# Altium project TMC4671-EVAL_V1_2.PrjPcb
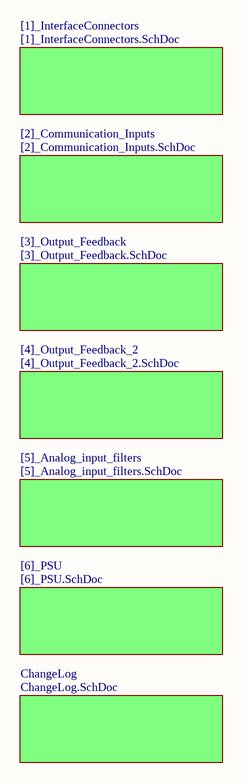
[diagram p0: TMC4671-EVAL_V1_2.SchDoc]
Interfaces: SPI, UART, S/D; Chip: TMCxxx; BoardVersion: 1.2; BoardName: TMC4671-EVAL
8 sheets, 149 parts. Net scope: flat (ports and power ports of the same name join across sheets).
Board file: TMC4671-EVAL_V1_2.PcbDoc
Sheets:
  TMC4671-EVAL_V1_2.SchDoc
    ChangeLog = ChangeLog.SchDoc
    [1]_InterfaceConnectors = [1]_InterfaceConnectors.SchDoc
    [2]_Communication_Inputs = [2]_Communication_Inputs.SchDoc
    [3]_Output_Feedback = [3]_Output_Feedback.SchDoc
    [4]_Output_Feedback_2 = [4]_Output_Feedback_2.SchDoc
    [5]_Analog_input_filters = [5]_Analog_input_filters.SchDoc
    [6]_PSU = [6]_PSU.SchDoc

## Sheet TMC4671-EVAL_V1_2.SchDoc: TMC4671_EVAL_V1.0
size A4; DocumentNumber: 0; SheetNumber: 0; SheetTotal: 8

### Sub-sheets
[1]_InterfaceConnectors = [1]_InterfaceConnectors.SchDoc: no entries
[2]_Communication_Inputs = [2]_Communication_Inputs.SchDoc: no entries
[3]_Output_Feedback = [3]_Output_Feedback.SchDoc: no entries
[4]_Output_Feedback_2 = [4]_Output_Feedback_2.SchDoc: no entries
[5]_Analog_input_filters = [5]_Analog_input_filters.SchDoc: no entries
[6]_PSU = [6]_PSU.SchDoc: no entries
ChangeLog = ChangeLog.SchDoc: no entries

### Notes on the sheet
- Title:
- Size:
- Date:
- A4
- Project:
- Time:
- Sheet
- Version:
- of
- File:

## Sheet ChangeLog.SchDoc: ChangeLog
size A4; DocumentNumber: 7; SheetNumber: 7; SheetTotal: 8
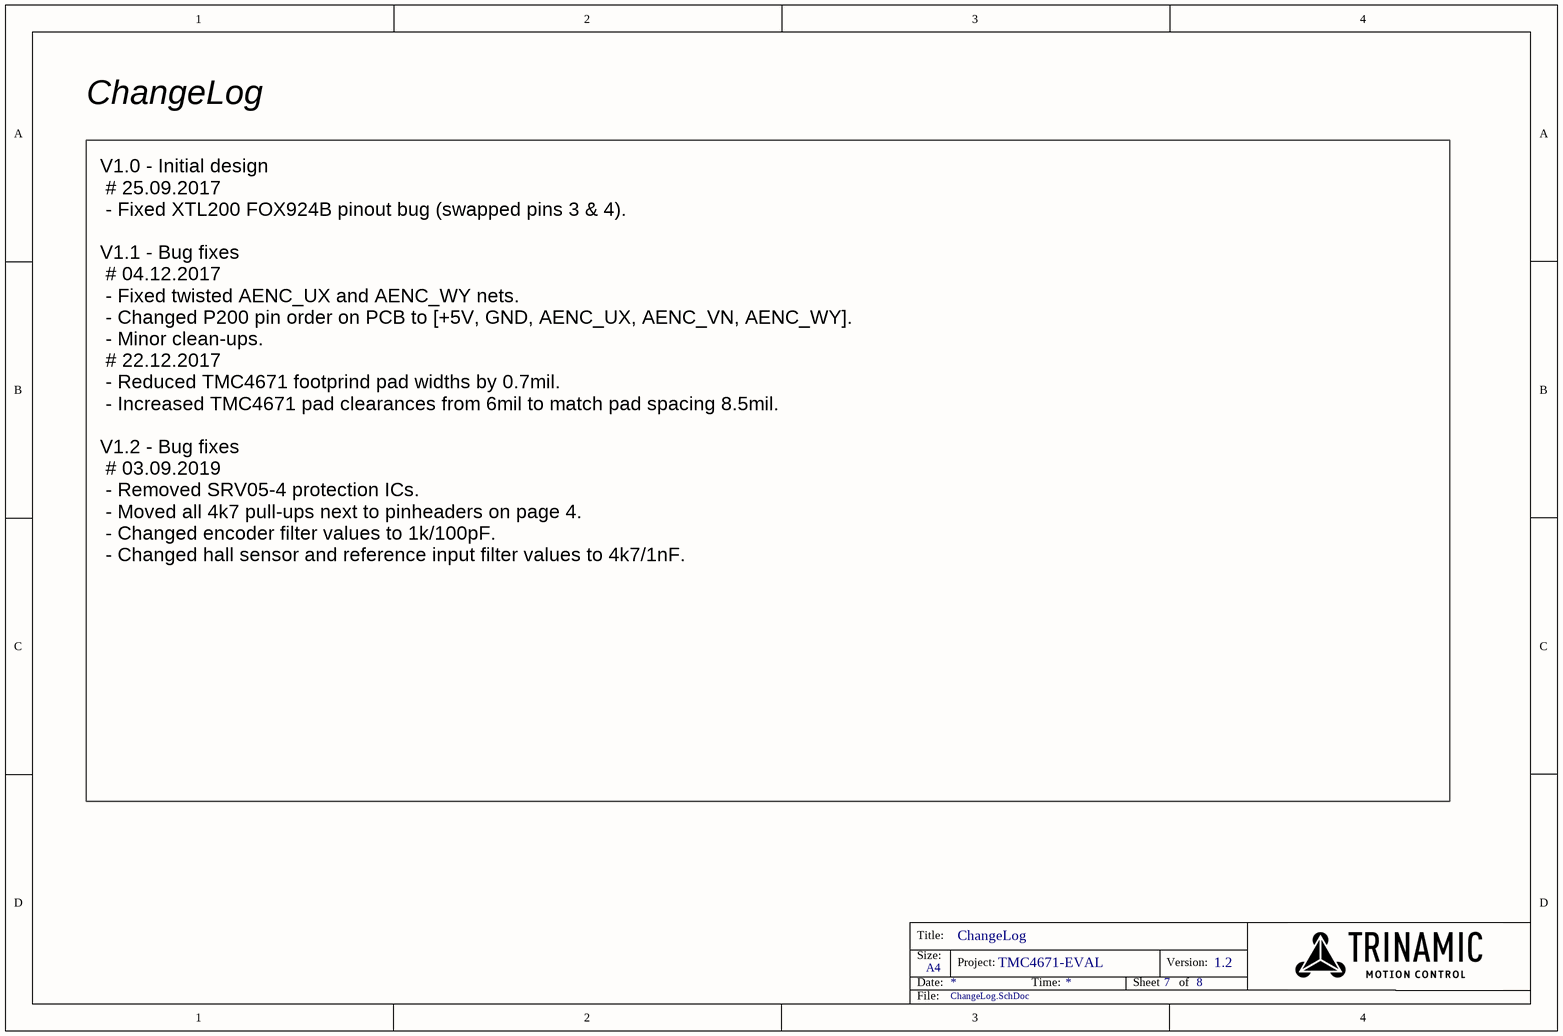
[diagram p1: ChangeLog.SchDoc]

### Notes on the sheet
- ChangeLog
- V1.0 - Initial design
  # 25.09.2017
  - Fixed XTL200 FOX924B pinout bug (swapped pins 3 & 4).
  V1.1 - Bug fixes
  # 04.12.2017
  - Fixed twisted AENC_UX and AENC_WY nets.
  - Changed P200 pin order on PCB to [+5V, GND, AENC_UX, AENC_VN, AENC_WY].
  - Minor clean-ups.
  # 22.12.2017
  - Reduced TMC4671 footprind pad widths by 0.7mil.
  - Increased TMC4671 pad clearances from 6mil to match pad spacing 8.5mil.
  V1.2 - Bug fixes
  # 03.09.2019
  - Removed SRV05-4 protection ICs.
  - Moved all 4k7 pull-ups next to pinheaders on page 4.
  - Changed encoder filter values to 1k/100pF.
  - Changed hall sensor and reference input filter values to 4k7/1nF.
- Title:
- Size:
- Date:
- A4
- Project:
- Time:
- Sheet
- Version:
- of
- File:

## Sheet [1]_InterfaceConnectors.SchDoc: Interface connectors, mounting holes & testpads
size A4; DocumentNumber: 1; SheetNumber: 1; SheetTotal: 8
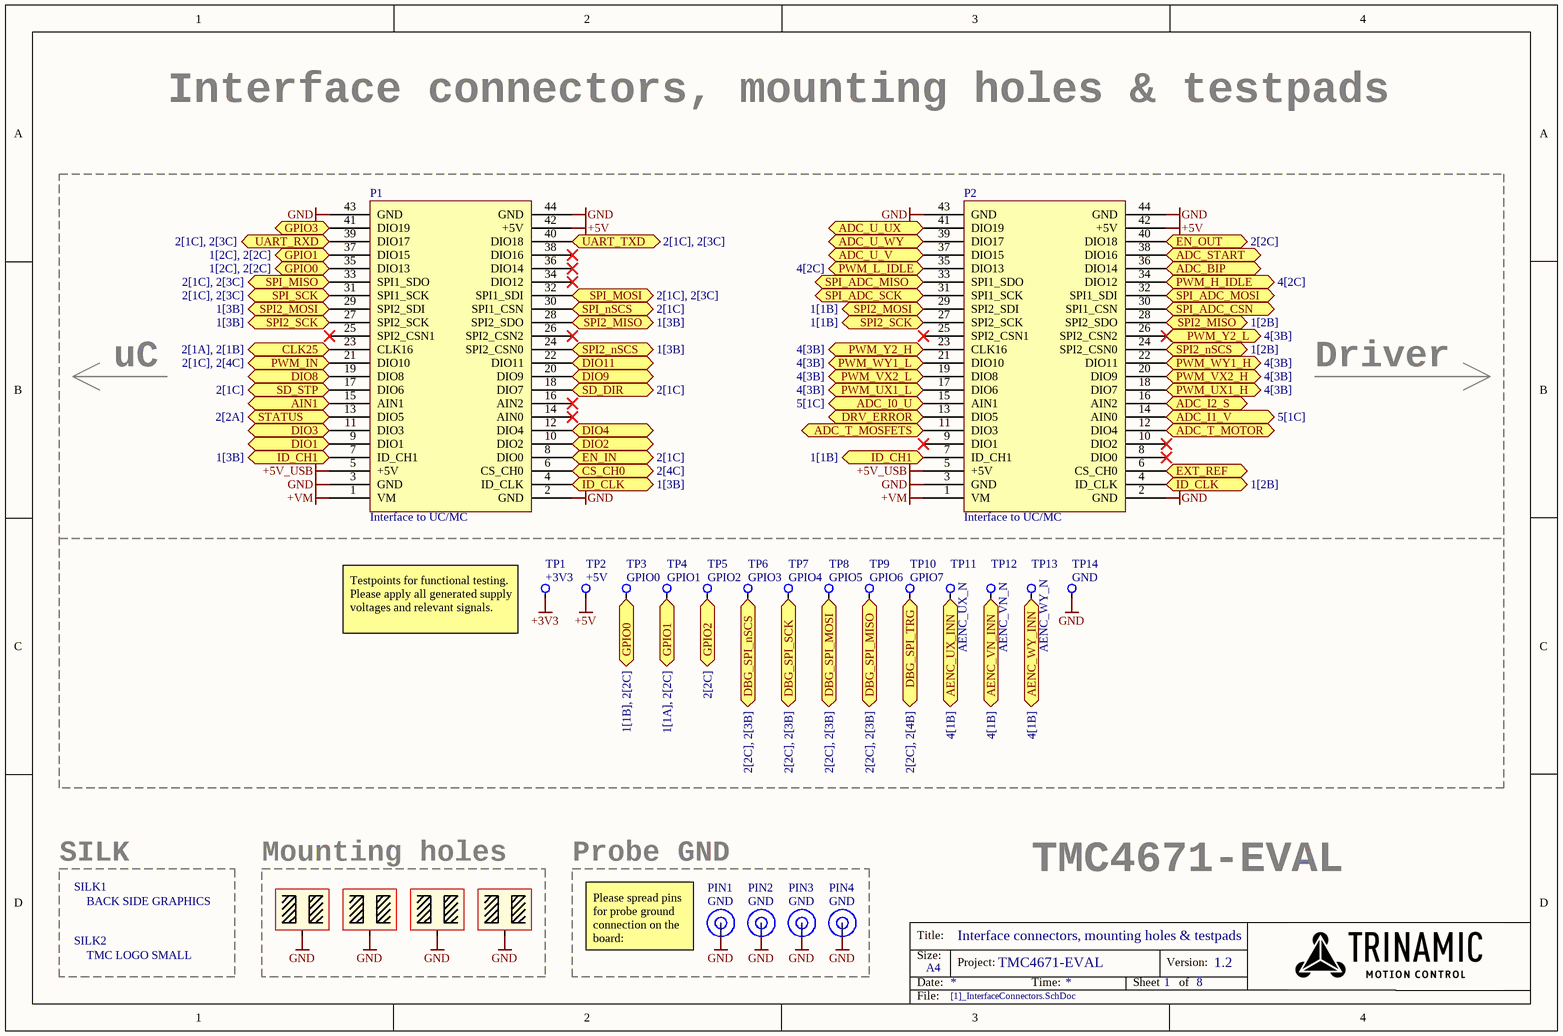
[diagram p2: [1]_InterfaceConnectors.SchDoc]

### Parts
MNT1  MOUNTING_HOLE  [MNT_HOLE_6.35-3.2]  (value not drawn)  (no BOM)
MNT2  MOUNTING_HOLE  [MNT_HOLE_6.35-3.2]  (value not drawn)  (no BOM)
MNT3  MOUNTING_HOLE  [MNT_HOLE_6.35-3.2]  (value not drawn)  (no BOM)
MNT4  MOUNTING_HOLE  [MNT_HOLE_6.35-3.2]  (value not drawn)  (no BOM)
P1  Interface to UC/MC  [Interface_Connector]
P2  Interface to UC/MC  [Interface_Connector]
PIN1  GND  [TP_1.1-1.85_OCT]  (no BOM)
PIN2  GND  [TP_1.1-1.85_OCT]  (no BOM)
PIN3  GND  [TP_1.1-1.85_OCT]  (no BOM)
PIN4  GND  [TP_1.1-1.85_OCT]  (no BOM)
SILK1  BACK SIDE GRAPHICS  [TMC4671_EVAL_v1_0_back_label]  (no BOM)
SILK2  TMC LOGO SMALL  [TMC_logo_small]  (no BOM)
TP1  +3V3  [TP_SMD_1.2MM_ROUND]  (no BOM)
TP2  +5V  [TP_SMD_1.2MM_ROUND]  (no BOM)
TP3  GPIO0  [TP_SMD_1.2MM_ROUND]  (no BOM)
TP4  GPIO1  [TP_SMD_1.2MM_ROUND]  (no BOM)
TP5  GPIO2  [TP_SMD_1.2MM_ROUND]  (no BOM)
TP6  GPIO3  [TP_SMD_1.2MM_ROUND]  (no BOM)
TP7  GPIO4  [TP_SMD_1.2MM_ROUND]  (no BOM)
TP8  GPIO5  [TP_SMD_1.2MM_ROUND]  (no BOM)
TP9  GPIO6  [TP_SMD_1.2MM_ROUND]  (no BOM)
TP10  GPIO7  [TP_SMD_1.2MM_ROUND]  (no BOM)
TP11  AENC_UX_N  [TP_SMD_1.2MM_ROUND]  (no BOM)
TP12  AENC_VN_N  [TP_SMD_1.2MM_ROUND]  (no BOM)
TP13  AENC_WY_N  [TP_SMD_1.2MM_ROUND]  (no BOM)
TP14  GND  [TP_SMD_1.2MM_ROUND]  (no BOM)

### Blocks framed on the sheet
SILK: SILK1 SILK2
Mounting holes: MNT1-MNT4
Probe GND: PIN1-PIN4

### Ports
ADC_BIP, ADC_I0_U (see 5[1C]), ADC_I1_V (see 5[1C]), ADC_I2_S, ADC_START, ADC_T_MOSFETS, ADC_T_MOTOR, ADC_U_UX, ADC_U_V, ADC_U_WY, AENC_UX_INN (see 4[1B]), AENC_VN_INN (see 4[1B]), AENC_WY_INN (see 4[1B]), AIN1, CLK25 (see 2[1A], 2[1B]), CS_CH0 (see 2[4C]), DBG_SPI_MISO (see 2[2C], 2[3B]), DBG_SPI_MOSI (see 2[2C], 2[3B]), DBG_SPI_nSCS (see 2[2C], 2[3B]), DBG_SPI_SCK (see 2[2C], 2[3B]), DBG_SPI_TRG (see 2[2C], 2[4B]), DIO1, DIO2, DIO3, DIO4, DIO8, DIO9, DIO11, DRV_ERROR, EN_IN (see 2[1C]), EN_OUT (see 2[2C]), EXT_REF, GPIO0 (see 1[1B], 2[2C]), GPIO0 (see 1[2C], 2[2C]), GPIO1 (see 1[1A], 2[2C]), GPIO1 (see 1[2C], 2[2C]), GPIO2 (see 2[2C]), GPIO3, ID_CH1 (see 1[1B]), ID_CH1 (see 1[3B]), ID_CLK (see 1[2B]), ID_CLK (see 1[3B]), PWM_H_IDLE (see 4[2C]), PWM_IN (see 2[1C], 2[4C]), PWM_L_IDLE (see 4[2C]), PWM_UX1_H (see 4[3B]), PWM_UX1_L (see 4[3B]), PWM_VX2_H (see 4[3B]), PWM_VX2_L (see 4[3B]), PWM_WY1_H (see 4[3B]), PWM_WY1_L (see 4[3B]), PWM_Y2_H (see 4[3B]), PWM_Y2_L (see 4[3B]), SD_DIR (see 2[1C]), SD_STP (see 2[1C]), SPI2_MISO (see 1[2B]), SPI2_MISO (see 1[3B]), SPI2_MOSI (see 1[1B]), SPI2_MOSI (see 1[3B]), SPI2_nSCS (see 1[2B]), SPI2_nSCS (see 1[3B]), SPI2_SCK (see 1[1B]), SPI2_SCK (see 1[3B]), SPI_ADC_CSN, SPI_ADC_MISO, SPI_ADC_MOSI, SPI_ADC_SCK, SPI_MISO (see 2[1C], 2[3C]), SPI_MOSI (see 2[1C], 2[3C]), SPI_nSCS (see 2[1C]), SPI_SCK (see 2[1C], 2[3C]), STATUS (see 2[2A]), UART_RXD (see 2[1C], 2[3C]), UART_TXD (see 2[1C], 2[3C])

### Nets
+3V3: TP1.1
+5V: P1.42(+5V) P2.42(+5V) TP2.1
+5V_USB: P1.5(+5V) P2.5(+5V)
+VM: P1.1(VM) P2.1(VM)
GND: MNT1.1 MNT2.1 MNT3.1 MNT4.1 P1.2(GND) P1.3(GND) P1.43(GND) P1.44(GND) P2.2(GND) P2.3(GND) P2.43(GND) P2.44(GND) PIN1.1 PIN2.1 PIN3.1 PIN4.1 TP14.1
ADC_BIP: P2.36(DIO14) ; port ADC_BIP
ADC_I0_U: P2.15(AIN1) ; port ADC_I0_U
ADC_I1_V: P2.14(AIN0) ; port ADC_I1_V
ADC_I2_S: P2.16(AIN2) ; port ADC_I2_S
ADC_START: P2.38(DIO16) ; port ADC_START
ADC_T_MOSFETS: P2.11(DIO3) ; port ADC_T_MOSFETS
ADC_T_MOTOR: P2.12(DIO4) ; port ADC_T_MOTOR
ADC_U_UX: P2.41(DIO19) ; port ADC_U_UX
ADC_U_V: P2.37(DIO15) ; port ADC_U_V
ADC_U_WY: P2.39(DIO17) ; port ADC_U_WY
AENC_UX_INN: TP11.1 ; port AENC_UX_INN
AENC_VN_INN: TP12.1 ; port AENC_VN_INN
AENC_WY_INN: TP13.1 ; port AENC_WY_INN
AIN1: P1.15(AIN1) ; port AIN1
CLK25: P1.23(CLK16) ; port CLK25
CS_CH0: P1.6(CS_CH0) ; port CS_CH0
DBG_SPI_MISO: TP9.1 ; port DBG_SPI_MISO
DBG_SPI_MOSI: TP8.1 ; port DBG_SPI_MOSI
DBG_SPI_nSCS: TP6.1 ; port DBG_SPI_nSCS
DBG_SPI_SCK: TP7.1 ; port DBG_SPI_SCK
DBG_SPI_TRG: TP10.1 ; port DBG_SPI_TRG
DIO1: P1.9(DIO1) ; port DIO1
DIO2: P1.10(DIO2) ; port DIO2
DIO3: P1.11(DIO3) ; port DIO3
DIO4: P1.12(DIO4) ; port DIO4
DIO8: P1.19(DIO8) ; port DIO8
DIO9: P1.20(DIO9) ; port DIO9
DIO11: P1.22(DIO11) ; port DIO11
DRV_ERROR: P2.13(DIO5) ; port DRV_ERROR
EN_IN: P1.8(DIO0) ; port EN_IN
EN_OUT: P2.40(DIO18) ; port EN_OUT
EXT_REF: P2.6(CS_CH0) ; port EXT_REF
GPIO0: P1.35(DIO13) TP3.1 ; port GPIO0
GPIO1: P1.37(DIO15) TP4.1 ; port GPIO1
GPIO2: TP5.1 ; port GPIO2
GPIO3: P1.41(DIO19) ; port GPIO3
ID_CH1: P1.7(ID_CH1) P2.7(ID_CH1) ; port ID_CH1
ID_CLK: P1.4(ID_CLK) P2.4(ID_CLK) ; port ID_CLK
PWM_H_IDLE: P2.34(DIO12) ; port PWM_H_IDLE
PWM_IN: P1.21(DIO10) ; port PWM_IN
PWM_L_IDLE: P2.35(DIO13) ; port PWM_L_IDLE
PWM_UX1_H: P2.18(DIO7) ; port PWM_UX1_H
PWM_UX1_L: P2.17(DIO6) ; port PWM_UX1_L
PWM_VX2_H: P2.20(DIO9) ; port PWM_VX2_H
PWM_VX2_L: P2.19(DIO8) ; port PWM_VX2_L
PWM_WY1_H: P2.22(DIO11) ; port PWM_WY1_H
PWM_WY1_L: P2.21(DIO10) ; port PWM_WY1_L
PWM_Y2_H: P2.23(CLK16) ; port PWM_Y2_H
PWM_Y2_L: P2.26(SPI2_CSN2) ; port PWM_Y2_L
SD_DIR: P1.18(DIO7) ; port SD_DIR
SD_STP: P1.17(DIO6) ; port SD_STP
SPI2_MISO: P1.28(SPI2_SDO) P2.28(SPI2_SDO) ; port SPI2_MISO
SPI2_MOSI: P1.29(SPI2_SDI) P2.29(SPI2_SDI) ; port SPI2_MOSI
SPI2_nSCS: P1.24(SPI2_CSN0) P2.24(SPI2_CSN0) ; port SPI2_nSCS
SPI2_SCK: P1.27(SPI2_SCK) P2.27(SPI2_SCK) ; port SPI2_SCK
SPI_ADC_CSN: P2.30(SPI1_CSN) ; port SPI_ADC_CSN
SPI_ADC_MISO: P2.33(SPI1_SDO) ; port SPI_ADC_MISO
SPI_ADC_MOSI: P2.32(SPI1_SDI) ; port SPI_ADC_MOSI
SPI_ADC_SCK: P2.31(SPI1_SCK) ; port SPI_ADC_SCK
SPI_MISO: P1.33(SPI1_SDO) ; port SPI_MISO
SPI_MOSI: P1.32(SPI1_SDI) ; port SPI_MOSI
SPI_nSCS: P1.30(SPI1_CSN) ; port SPI_nSCS
SPI_SCK: P1.31(SPI1_SCK) ; port SPI_SCK
STATUS: P1.13(DIO5) ; port STATUS
UART_RXD: P1.39(DIO17) ; port UART_RXD
UART_TXD: P1.40(DIO18) ; port UART_TXD

Not connected (* = marked no-connect by the designer): P1 14(AIN0)* 16(AIN2)* 25(SPI2_CSN1)* 26(SPI2_CSN2)* 34(DIO12)* 36(DIO14)* 38(DIO16)*; P2 8(DIO0)* 9(DIO1)* 10(DIO2)* 25(SPI2_CSN1)*

### Notes on the sheet
- uC
- Driver
- (near TP1) Testpoints for functional testing.
  Please apply all generated supply voltages and relevant signals.
- (near PIN1) Please spread pins for probe ground connection on the board:
- Title:
- Size:
- Date:
- A4
- Project:
- Time:
- Sheet
- Version:
- of
- File:

### Library data of the parts
P1 P2 = Interface Connector, 44 Pins: Board-To-Board Connector, 2.54 mm, 44 Contacts, Receptacle, HLE Series, Surface Mount, 2 Rows; MPN: HLE-122-02-L-DV; MF: SAMTEC
PIN1-PIN4 = TP_1.1-1.85_OCT: TH testpoint, 1.1 hole, 1.85 pad, octagonal
SILK1 SILK2 = SILK_GFX
TP1-TP14 = TP_SMD_Xmm: SMD testpoint, 1.2mm pad, round

## Sheet [2]_Communication_Inputs.SchDoc: Communication & Inputs
size A4; DocumentNumber: 2; SheetNumber: 2; SheetTotal: 8
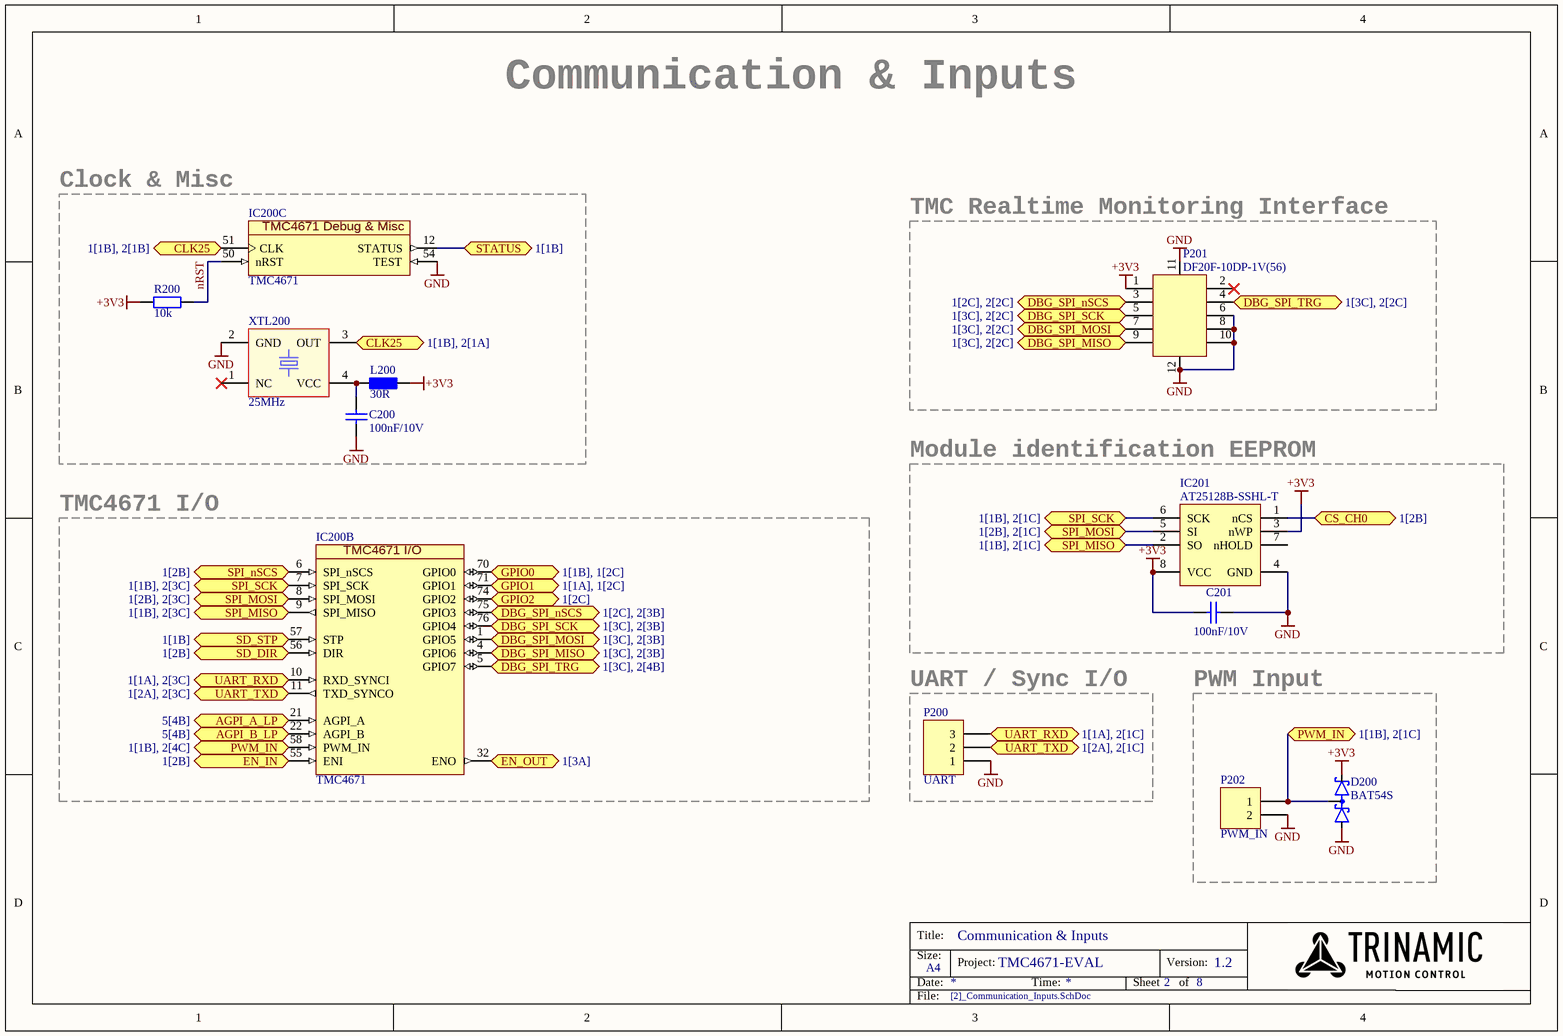
[diagram p3: [2]_Communication_Inputs.SchDoc]

### Parts
C200  100nF/10V  [C0603]
C201  100nF/10V  [C0603]
D200  BAT54S  [SOT95P237X130-3N]
IC200  TMC4671  [QFN40P1050X650X90_HS-77N]  (parts B,C of 5)
IC201  AT25128B-SSHL-T  [SOP127P600X175-8N]
L200  30R  [L0603]
P200  UART  [TH_HDR_1X3]
P201  DF20F-10DP-1V(56)  [CON, TMC Debug SPI]
P202  PWM_IN  [TH_HDR_1X2]
R200  10k  [R0603]
XTL200  25MHz  [FOX924B-25.000]

### Blocks framed on the sheet
Clock & Misc: C200 IC200 L200 R200 XTL200
TMC Realtime Monitoring Interface: P201
TMC4671 I/O: IC200
Module identification EEPROM: C201 IC201
UART / Sync I/O: P200
PWM Input: D200 P202

### Ports
AGPI_A_LP (see 5[4B]), AGPI_B_LP (see 5[4B]), CLK25 (see 1[1B], 2[1A]), CLK25 (see 1[1B], 2[1B]), CS_CH0 (see 1[2B]), DBG_SPI_MISO (see 1[3C], 2[2C]), DBG_SPI_MISO (see 1[3C], 2[3B]), DBG_SPI_MOSI (see 1[3C], 2[2C]), DBG_SPI_MOSI (see 1[3C], 2[3B]), DBG_SPI_nSCS (see 1[2C], 2[2C]), DBG_SPI_nSCS (see 1[2C], 2[3B]), DBG_SPI_SCK (see 1[3C], 2[2C]), DBG_SPI_SCK (see 1[3C], 2[3B]), DBG_SPI_TRG (see 1[3C], 2[2C]), DBG_SPI_TRG (see 1[3C], 2[4B]), EN_IN (see 1[2B]), EN_OUT (see 1[3A]), GPIO0 (see 1[1B], 1[2C]), GPIO1 (see 1[1A], 1[2C]), GPIO2 (see 1[2C]), PWM_IN (see 1[1B], 2[1C]), PWM_IN (see 1[1B], 2[4C]), SD_DIR (see 1[2B]), SD_STP (see 1[1B]), SPI_MISO (see 1[1B], 2[1C]), SPI_MISO (see 1[1B], 2[3C]), SPI_MOSI (see 1[2B], 2[1C]), SPI_MOSI (see 1[2B], 2[3C]), SPI_nSCS (see 1[2B]), SPI_SCK (see 1[1B], 2[1C]), SPI_SCK (see 1[1B], 2[3C]), STATUS (see 1[1B]), UART_RXD (see 1[1A], 2[1C]), UART_RXD (see 1[1A], 2[3C]), UART_TXD (see 1[2A], 2[1C]), UART_TXD (see 1[2A], 2[3C])

### Nets
+3V3: C201.2 D200.2(C2) IC201.3(nWP) IC201.8(VCC) L200.1 P201.1 R200.2
GND: C200.2 C201.1 D200.1(A1) IC200.54(TEST) IC201.4(GND) P200.1 P201.6 P201.8 P201.10 P201.11 P201.12 P202.2 XTL200.2(GND)
AGPI_A_LP: IC200.21(AGPI_A) ; port AGPI_A_LP
AGPI_B_LP: IC200.22(AGPI_B) ; port AGPI_B_LP
CLK25: IC200.51(CLK) XTL200.3(OUT) ; port CLK25
CS_CH0: IC201.1(nCS) ; port CS_CH0
DBG_SPI_MISO: IC200.4(GPIO6) P201.9 ; port DBG_SPI_MISO
DBG_SPI_MOSI: IC200.1(GPIO5) P201.7 ; port DBG_SPI_MOSI
DBG_SPI_nSCS: IC200.75(GPIO3) P201.3 ; port DBG_SPI_nSCS
DBG_SPI_SCK: IC200.76(GPIO4) P201.5 ; port DBG_SPI_SCK
DBG_SPI_TRG: IC200.5(GPIO7) P201.4 ; port DBG_SPI_TRG
EN_IN: IC200.55(ENI) ; port EN_IN
EN_OUT: IC200.32(ENO) ; port EN_OUT
GPIO0: IC200.70(GPIO0) ; port GPIO0
GPIO1: IC200.71(GPIO1) ; port GPIO1
GPIO2: IC200.74(GPIO2) ; port GPIO2
nRST: IC200.50(nRST) R200.1
PWM_IN: D200.3(C1A2) IC200.58(PWM_IN) P202.1 ; port PWM_IN
SD_DIR: IC200.56(DIR) ; port SD_DIR
SD_STP: IC200.57(STP) ; port SD_STP
SPI_MISO: IC200.9(SPI_MISO) IC201.2(SO) ; port SPI_MISO
SPI_MOSI: IC200.8(SPI_MOSI) IC201.5(SI) ; port SPI_MOSI
SPI_nSCS: IC200.6(SPI_nSCS) ; port SPI_nSCS
SPI_SCK: IC200.7(SPI_SCK) IC201.6(SCK) ; port SPI_SCK
STATUS: IC200.12(STATUS) ; port STATUS
UART_RXD: IC200.10(RXD_SYNCI) P200.3 ; port UART_RXD
UART_TXD: IC200.11(TXD_SYNCO) P200.2 ; port UART_TXD
NetC200_1: C200.1 L200.2 XTL200.4(VCC)

Not connected (* = marked no-connect by the designer): IC201 7(nHOLD); P201 2*; XTL200 1(NC)*

### Notes on the sheet
- Title:
- Size:
- Date:
- A4
- Project:
- Time:
- Sheet
- Version:
- of
- File:
- (in symbol TMC4671, part B) TMC4671 I/O
- (in symbol TMC4671, part C) TMC4671 Debug & Misc

### Library data of the parts
C200 C201 = C, 0.1 µF, 10 V, ± 10%, X7R, 0603: SMD Multilayer Ceramic Capacitor, 0603 [1608 Metric], 0.1 µF, 10 V, ± 10%, X7R, MC Series; MPN: MC0603B104K100CT; Type: MLCC; VoltageRating: 10V; MF: Multicomp; Capacitance: 100nF; Characteristic: X7R; ComponentLinknURL: *; Precision: 10%
D200 = BAT54S: Small Signal Schottky Diode, Dual Series, 30 V, 200 mA, 1 V, 600 mA, 125 °C; MF: TAIWAN SEMICONDUCTOR; MPN: BAT54S
IC200 = TMC4671: MF: TRINAMIC; MPN: TMC4671
IC201 = EEPROM_ AT25128B-SSHL-T: EEPROM, SPI, 128 Kbit, 16K x 8bit, 20 MHz, SOIC, 8 Pins; MF: MICROCHIP; MPN: AT25128B-SSHL-T
L200 = FB, 30 ohm, 0603 [1608 Metric], MFB Series, 3 A, 0.04 ohm, ± 25%: Ferrite Bead, 30 ohm, 0603 [1608 Metric], MFB Series, 3 A, 0.04 ohm, ± 25%; MPN: MFB-160808-0030PQ; MF: MEC MARCOM; DC Current Rating: 3A; DC Resistance Max:: 0R04; Tolerance: ±25%; Impedance: 30R
P200 = Header 3: Header, 3-Pin; Note: Not fitted
P201 = CON, TMC Debug SPI: Wire-To-Board Connector, 1 mm, 10 Contacts, Header, DF20 Series, Surface Mount, 2 Rows; MF: Hirose Electric Co Ltd; MPN: DF20F-10DP-1V(56)
P202 = Header 2: Header, 2-Pin; Note: Not fitted
R200 = R, 10 kohm, 50 V, 0603 [1608 Metric], 63 mW, ± 1%, MC Series: SMD Chip Resistor, Thick Film, 10 kohm, 50 V, 0603 [1608 Metric], 63 mW, ± 1%, MC Series; MPN: MC0063W0603110K; VoltageRating: 50V; Temp coefficient: *ppm; PowerRating: 63mW; MF: MULTICOMP; Precision: 1%; Resistance: 10k
XTL200 = 25 MHz, 2.5 ppm, SMD, 5mm x 3.2mm, HCMOS, 3.3 V, FOX924 Series: TCXO, 25 MHz, 2.5 ppm, SMD, 5mm x 3.2mm, HCMOS, 3.3 V, FOX924 Series; MF: FOX ELECTRONICS; Freq. Stability: 2.5ppm; Op.temp.: -30°C...+80°C; MPN: FOX924B-25.000; Freq.: 25MHz

## Sheet [3]_Output_Feedback.SchDoc: Output & Feedback
size A4 portrait; DocumentNumber: 3; SheetNumber: 3; SheetTotal: 8
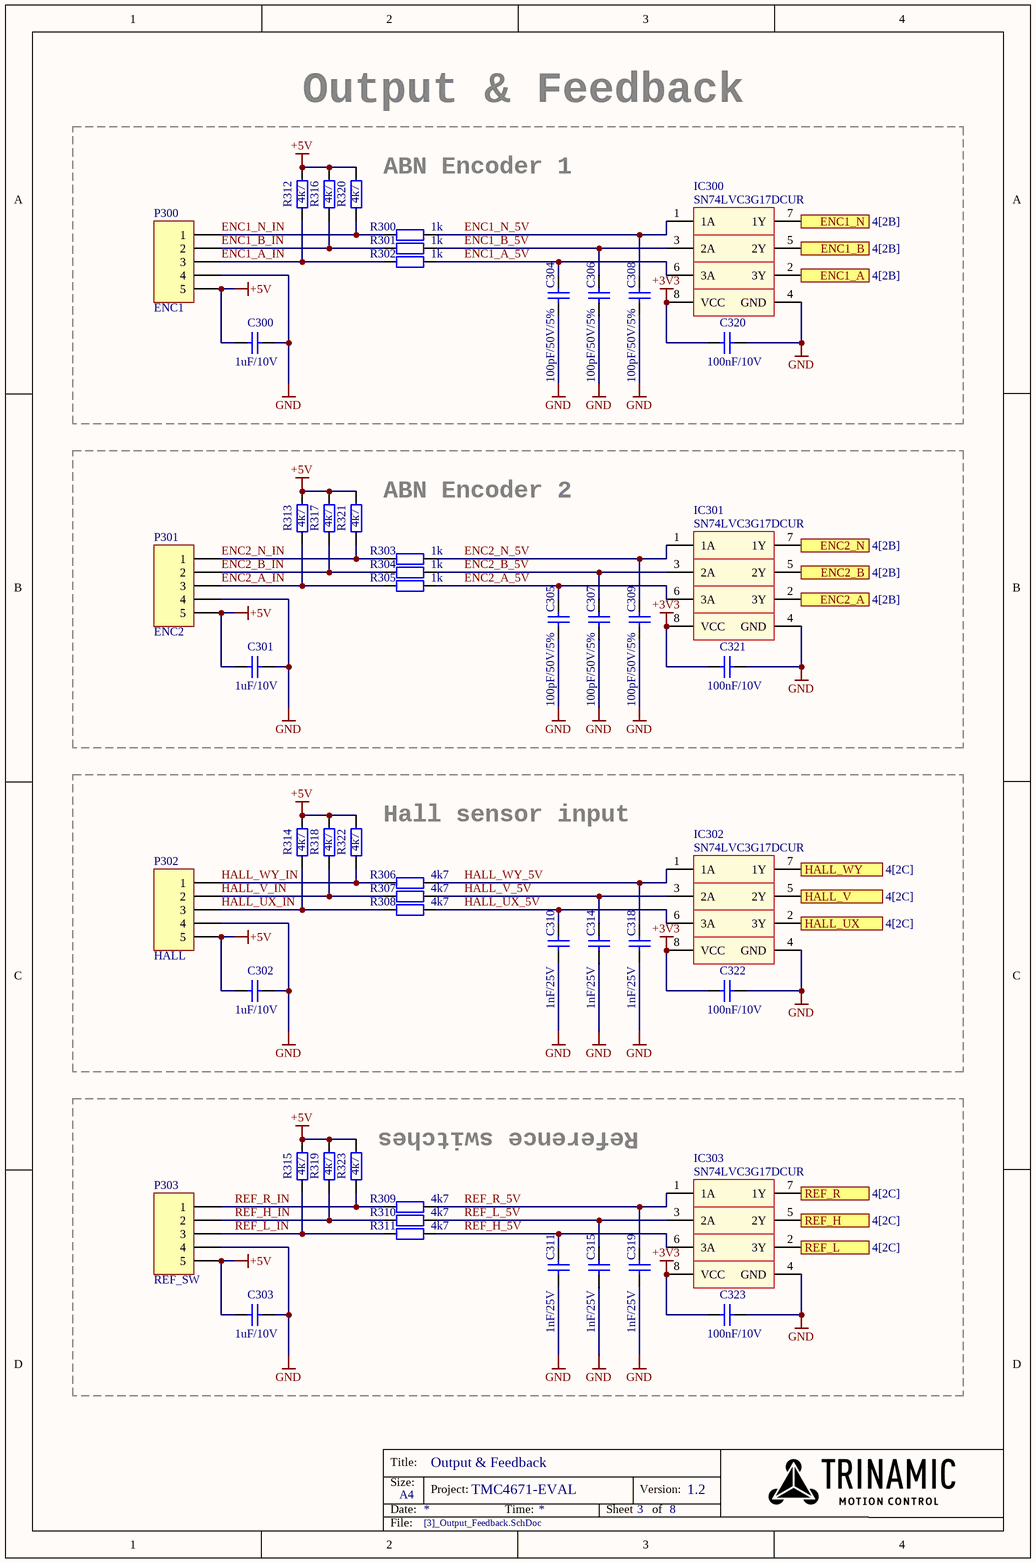
[diagram p4: [3]_Output_Feedback.SchDoc]

### Parts
C300  1uF/10V  [C0603]
C301  1uF/10V  [C0603]
C302  1uF/10V  [C0603]
C303  1uF/10V  [C0603]
C304  100pF/50V/5%  [C0603]
C305  100pF/50V/5%  [C0603]
C306  100pF/50V/5%  [C0603]
C307  100pF/50V/5%  [C0603]
C308  100pF/50V/5%  [C0603]
C309  100pF/50V/5%  [C0603]
C310  1nF/25V  [C0603]
C311  1nF/25V  [C0603]
C314  1nF/25V  [C0603]
C315  1nF/25V  [C0603]
C318  1nF/25V  [C0603]
C319  1nF/25V  [C0603]
C320  100nF/10V  [C0603]
C321  100nF/10V  [C0603]
C322  100nF/10V  [C0603]
C323  100nF/10V  [C0603]
IC300  SN74LVC3G17DCUR  [TSSOP50P310X90-8L]
IC301  SN74LVC3G17DCUR  [TSSOP50P310X90-8L]
IC302  SN74LVC3G17DCUR  [TSSOP50P310X90-8L]
IC303  SN74LVC3G17DCUR  [TSSOP50P310X90-8L]
P300  ENC1  [TH_HDR_1X5]
P301  ENC2  [TH_HDR_1X5]
P302  HALL  [TH_HDR_1X5]
P303  REF_SW  [TH_HDR_1X5]
R300  1k  [R0603]
R301  1k  [R0603]
R302  1k  [R0603]
R303  1k  [R0603]
R304  1k  [R0603]
R305  1k  [R0603]
R306  4k7  [R0603]
R307  4k7  [R0603]
R308  4k7  [R0603]
R309  4k7  [R0603]
R310  4k7  [R0603]
R311  4k7  [R0603]
R312  4k7  [R0603]
R313  4k7  [R0603]
R314  4k7  [R0603]
R315  4k7  [R0603]
R316  4k7  [R0603]
R317  4k7  [R0603]
R318  4k7  [R0603]
R319  4k7  [R0603]
R320  4k7  [R0603]
R321  4k7  [R0603]
R322  4k7  [R0603]
R323  4k7  [R0603]

### Blocks framed on the sheet
ABN Encoder 1: C300 C304 C306 C308 C320 IC300 P300 R300-R302 R312 R316 R320
ABN Encoder 2: C301 C305 C307 C309 C321 IC301 P301 R303-R305 R313 R317 R321
Hall sensor input: C302 C310 C314 C318 C322 IC302 P302 R306-R308 R314 R318 R322
Reference switches: C303 C311 C315 C319 C323 IC303 P303 R309-R311 R315 R319 R323

### Ports
ENC1_A (see 4[2B]), ENC1_B (see 4[2B]), ENC1_N (see 4[2B]), ENC2_A (see 4[2B]), ENC2_B (see 4[2B]), ENC2_N (see 4[2B]), HALL_UX (see 4[2C]), HALL_V (see 4[2C]), HALL_WY (see 4[2C]), REF_H (see 4[2C]), REF_L (see 4[2C]), REF_R (see 4[2C])

### Nets
+3V3: C320.2 C321.2 C322.2 C323.2 IC300.8(VCC) IC301.8(VCC) IC302.8(VCC) IC303.8(VCC)
+5V: C300.2 C301.2 C302.2 C303.2 P300.5 P301.5 P302.5 P303.5 R312.2 R313.2 R314.2 R315.2 R316.2 R317.2 R318.2 R319.2 R320.2 R321.2 R322.2 R323.2
GND: C300.1 C301.1 C302.1 C303.1 C304.1 C305.1 C306.1 C307.1 C308.1 C309.1 C310.1 C311.1 C314.1 C315.1 C318.1 C319.1 C320.1 C321.1 C322.1 C323.1 IC300.4(GND) IC301.4(GND) IC302.4(GND) IC303.4(GND) P300.4 P301.4 P302.4 P303.4
ENC1_A: IC300.2(3Y) ; port ENC1_A
ENC1_A_5V: C304.2 IC300.6(3A) R302.2
ENC1_A_IN: P300.3 R302.1 R312.1
ENC1_B: IC300.5(2Y) ; port ENC1_B
ENC1_B_5V: C306.2 IC300.3(2A) R301.2
ENC1_B_IN: P300.2 R301.1 R316.1
ENC1_N: IC300.7(1Y) ; port ENC1_N
ENC1_N_5V: C308.2 IC300.1(1A) R300.2
ENC1_N_IN: P300.1 R300.1 R320.1
ENC2_A: IC301.2(3Y) ; port ENC2_A
ENC2_A_5V: C305.2 IC301.6(3A) R305.2
ENC2_A_IN: P301.3 R305.1 R313.1
ENC2_B: IC301.5(2Y) ; port ENC2_B
ENC2_B_5V: C307.2 IC301.3(2A) R304.2
ENC2_B_IN: P301.2 R304.1 R317.1
ENC2_N: IC301.7(1Y) ; port ENC2_N
ENC2_N_5V: C309.2 IC301.1(1A) R303.2
ENC2_N_IN: P301.1 R303.1 R321.1
HALL_UX: IC302.2(3Y) ; port HALL_UX
HALL_UX_5V: C310.2 IC302.6(3A) R308.1
HALL_UX_IN: P302.3 R308.2 R314.1
HALL_V: IC302.5(2Y) ; port HALL_V
HALL_V_5V: C314.2 IC302.3(2A) R307.1
HALL_V_IN: P302.2 R307.2 R318.1
HALL_WY: IC302.7(1Y) ; port HALL_WY
HALL_WY_5V: C318.2 IC302.1(1A) R306.1
HALL_WY_IN: P302.1 R306.2 R322.1
REF_H: IC303.5(2Y) ; port REF_H
REF_H_5V: C311.2 IC303.6(3A) R311.1
REF_H_IN: P303.2 R310.2 R319.1
REF_L: IC303.2(3Y) ; port REF_L
REF_L_5V: C315.2 IC303.3(2A) R310.1
REF_L_IN: P303.3 R311.2 R315.1
REF_R: IC303.7(1Y) ; port REF_R
REF_R_5V: C319.2 IC303.1(1A) R309.1
REF_R_IN: P303.1 R309.2 R323.1

### Notes on the sheet
- Title:
- Size:
- Date:
- A4
- Project:
- Time:
- Sheet
- Version:
- of
- File:

### Library data of the parts
C300-C303 = C, 1 µF, 10 V, ± 10%, X5R, MC Series, 0603 [1608 Metric]: SMD Multilayer Ceramic Capacitor, 0603 [1608 Metric], 1 µF, 10 V, ± 10%, X5R, MC Series; MPN: MC0603X105K100CT; Type: MLCC; VoltageRating: 10V; MF: MULTICOMP; Capacitance: 1uF; Characteristic: X5R; Precision: 10%
C304-C309 = C, 100 pF, 50 V, ± 5%, C0G / NP0, MC Series, 0603 [1608 Metric]: SMD Multilayer Ceramic Capacitor, 0603 [1608 Metric], 100 pF, 50 V, ± 5%, C0G / NP0, MC Series; MPN: MC0603N101J500CT; Type: MLCC; VoltageRating: 50V; MF: MULTICOMP; Capacitance: 100pF; Characteristic: C0G / NP0; Precision: 5%
C310 C311 C314 C315 C318 C319 = C, 1nF, 25 V, ± 10%, X7R, MC Series, 0603 [1608 Metric]: SMD Multilayer Ceramic Capacitor, 0603 [1608 Metric], 1000 pF, 25 V, ± 10%, X7R, MC Series; MPN: MC0603B102K250CT; Type: MLCC; VoltageRating: 25V; MF: MULTICOMP; Capacitance: 1nF; Characteristic: X7R; Precision: 10%
C320-C323 = C, 0.1 µF, 10 V, ± 10%, X7R, 0603: as C200 on sheet [2]_Communication_Inputs; Characteristic: X7R; ComponentLinknURL: *; Precision: 10%
IC300-IC303 = SN74LVC3G17DCUR: Triple Schmitt-Trigger Buffer, 74LVC3G17, 1.65 V to 5.5 V, VSSOP-8; MF: TEXAS INSTRUMENTS; MPN: SN74LVC3G17DCUR
P300-P303 = Header 5: Header, 5-Pin
R300-R305 = R, 1 kohm, 50 V, 0603 [1608 Metric], 100mW, ± 1%, MCWR Series: SMD Chip Resistor, Thick Film, 1 kohm, 50 V, 0603 [1608 Metric], 100 mW, ± 1%, MCWR Series; MPN: MCWR06X1001FTL; VoltageRating: 50V; Temp coefficient: *ppm; PowerRating: 100mW; MF: MULTICOMP; Precision: 1%; Resistance: 1k
R306-R323 = R, 4.7 kohm, 75 V, 0603 [1608 Metric], 100 mW, ± 1%, WR06 Series: SMD Chip Resistor, 4.7 kohm, 75 V, 0603 [1608 Metric], 100 mW, ± 1%, WR06 Series; MPN: WR06X4701FTL; VoltageRating: 75V; Temp coefficient: *ppm; PowerRating: 100mW; MF: WALSIN; Precision: 1%; Resistance: 4k7

## Sheet [4]_Output_Feedback_2.SchDoc: Output & Feedback 2
size A4; DocumentNumber: 4; SheetNumber: 4; SheetTotal: 8
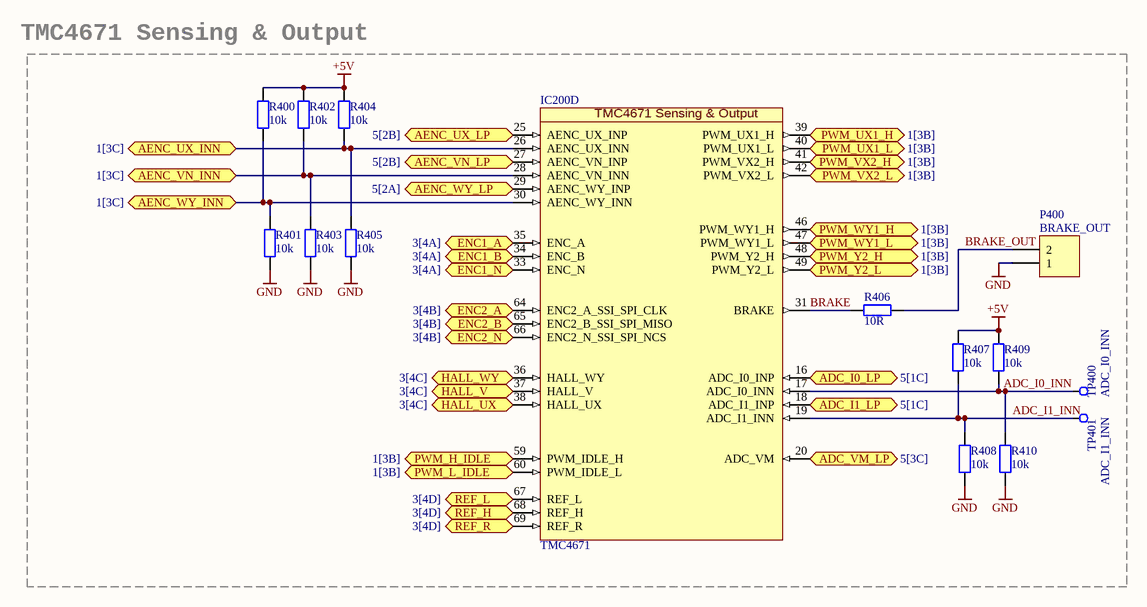
[diagram p5: [4]_Output_Feedback_2.SchDoc]

### Parts
IC200  TMC4671  [QFN40P1050X650X90_HS-77N]  (part D of 5)
P400  BRAKE_OUT  [TH_HDR_1X2]
R400  10k  [R0603]
R401  10k  [R0603]
R402  10k  [R0603]
R403  10k  [R0603]
R404  10k  [R0603]
R405  10k  [R0603]
R406  10R  [R0603]
R407  10k  [R0603]
R408  10k  [R0603]
R409  10k  [R0603]
R410  10k  [R0603]
TP400  ADC_I0_INN  [TP_SMD_1.2MM_ROUND]  (no BOM)
TP401  ADC_I1_INN  [TP_SMD_1.2MM_ROUND]  (no BOM)

### Ports
ADC_I0_LP (see 5[1C]), ADC_I1_LP (see 5[1C]), ADC_VM_LP (in, see 5[3C]), AENC_UX_INN (see 1[3C]), AENC_UX_LP (see 5[2B]), AENC_VN_INN (see 1[3C]), AENC_VN_LP (see 5[2B]), AENC_WY_INN (see 1[3C]), AENC_WY_LP (see 5[2A]), ENC1_A (see 3[4A]), ENC1_B (see 3[4A]), ENC1_N (see 3[4A]), ENC2_A (see 3[4B]), ENC2_B (see 3[4B]), ENC2_N (see 3[4B]), HALL_UX (see 3[4C]), HALL_V (see 3[4C]), HALL_WY (see 3[4C]), PWM_H_IDLE (see 1[3B]), PWM_L_IDLE (see 1[3B]), PWM_UX1_H (see 1[3B]), PWM_UX1_L (see 1[3B]), PWM_VX2_H (see 1[3B]), PWM_VX2_L (see 1[3B]), PWM_WY1_H (see 1[3B]), PWM_WY1_L (see 1[3B]), PWM_Y2_H (see 1[3B]), PWM_Y2_L (see 1[3B]), REF_H (see 3[4D]), REF_L (see 3[4D]), REF_R (see 3[4D])

### Nets
+5V: R400.2 R402.2 R404.2 R407.2 R409.2
GND: P400.1 R401.1 R403.1 R405.1 R408.1 R410.1
ADC_I0_INN: IC200.17(ADC_I0_INN) R409.1 R410.2 TP400.1
ADC_I0_LP: IC200.16(ADC_I0_INP) ; port ADC_I0_LP
ADC_I1_INN: IC200.19(ADC_I1_INN) R407.1 R408.2 TP401.1
ADC_I1_LP: IC200.18(ADC_I1_INP) ; port ADC_I1_LP
ADC_VM_LP: IC200.20(ADC_VM) ; port ADC_VM_LP
AENC_UX_INN: IC200.26(AENC_UX_INN) R404.1 R405.2 ; port AENC_UX_INN
AENC_UX_LP: IC200.25(AENC_UX_INP) ; port AENC_UX_LP
AENC_VN_INN: IC200.28(AENC_VN_INN) R402.1 R403.2 ; port AENC_VN_INN
AENC_VN_LP: IC200.27(AENC_VN_INP) ; port AENC_VN_LP
AENC_WY_INN: IC200.30(AENC_WY_INN) R400.1 R401.2 ; port AENC_WY_INN
AENC_WY_LP: IC200.29(AENC_WY_INP) ; port AENC_WY_LP
BRAKE: IC200.31(BRAKE) R406.2
BRAKE_OUT: P400.2 R406.1
ENC1_A: IC200.35(ENC_A) ; port ENC1_A
ENC1_B: IC200.34(ENC_B) ; port ENC1_B
ENC1_N: IC200.33(ENC_N) ; port ENC1_N
ENC2_A: IC200.64(ENC2_A_SSI_SPI_CLK) ; port ENC2_A
ENC2_B: IC200.65(ENC2_B_SSI_SPI_MISO) ; port ENC2_B
ENC2_N: IC200.66(ENC2_N_SSI_SPI_NCS) ; port ENC2_N
HALL_UX: IC200.38(HALL_UX) ; port HALL_UX
HALL_V: IC200.37(HALL_V) ; port HALL_V
HALL_WY: IC200.36(HALL_WY) ; port HALL_WY
PWM_H_IDLE: IC200.59(PWM_IDLE_H) ; port PWM_H_IDLE
PWM_L_IDLE: IC200.60(PWM_IDLE_L) ; port PWM_L_IDLE
PWM_UX1_H: IC200.39(PWM_UX1_H) ; port PWM_UX1_H
PWM_UX1_L: IC200.40(PWM_UX1_L) ; port PWM_UX1_L
PWM_VX2_H: IC200.41(PWM_VX2_H) ; port PWM_VX2_H
PWM_VX2_L: IC200.42(PWM_VX2_L) ; port PWM_VX2_L
PWM_WY1_H: IC200.46(PWM_WY1_H) ; port PWM_WY1_H
PWM_WY1_L: IC200.47(PWM_WY1_L) ; port PWM_WY1_L
PWM_Y2_H: IC200.48(PWM_Y2_H) ; port PWM_Y2_H
PWM_Y2_L: IC200.49(PWM_Y2_L) ; port PWM_Y2_L
REF_H: IC200.68(REF_H) ; port REF_H
REF_L: IC200.67(REF_L) ; port REF_L
REF_R: IC200.69(REF_R) ; port REF_R

### Notes on the sheet
- TMC4671 Sensing & Output
- Title:
- Size:
- Date:
- A4
- Project:
- Time:
- Sheet
- Version:
- of
- File:
- (in symbol TMC4671, part D) TMC4671 Sensing & Output

### Library data of the parts
IC200 = TMC4671: MF: TRINAMIC; MPN: TMC4671
P400 = Header 2: Header, 2-Pin
R400-R405 R407-R410 = R, 10 kohm, 50 V, 0603 [1608 Metric], 63 mW, ± 1%, MC Series: as R200 on sheet [2]_Communication_Inputs; Precision: 1%; Resistance: 10k
R406 = R, 10 ohm, 50 V, 0603 [1608 Metric], 100 mW, ± 1%, MCWR Series: SMD Chip Resistor, Thick Film, 10 ohm, 50 V, 0603 [1608 Metric], 100 mW, ± 1%, MCWR Series; MPN: MC0063W0603110K; VoltageRating: 50V; Temp coefficient: *ppm; PowerRating: 100mW; MF: MULTICOMP; Precision: 1%; Resistance: 10R
TP400 TP401 = TP_SMD_Xmm: SMD testpoint, 1.2mm pad, round

## Sheet [5]_Analog_input_filters.SchDoc: Analog inputs & filters
size A4; DocumentNumber: 5; SheetNumber: 5; SheetTotal: 8
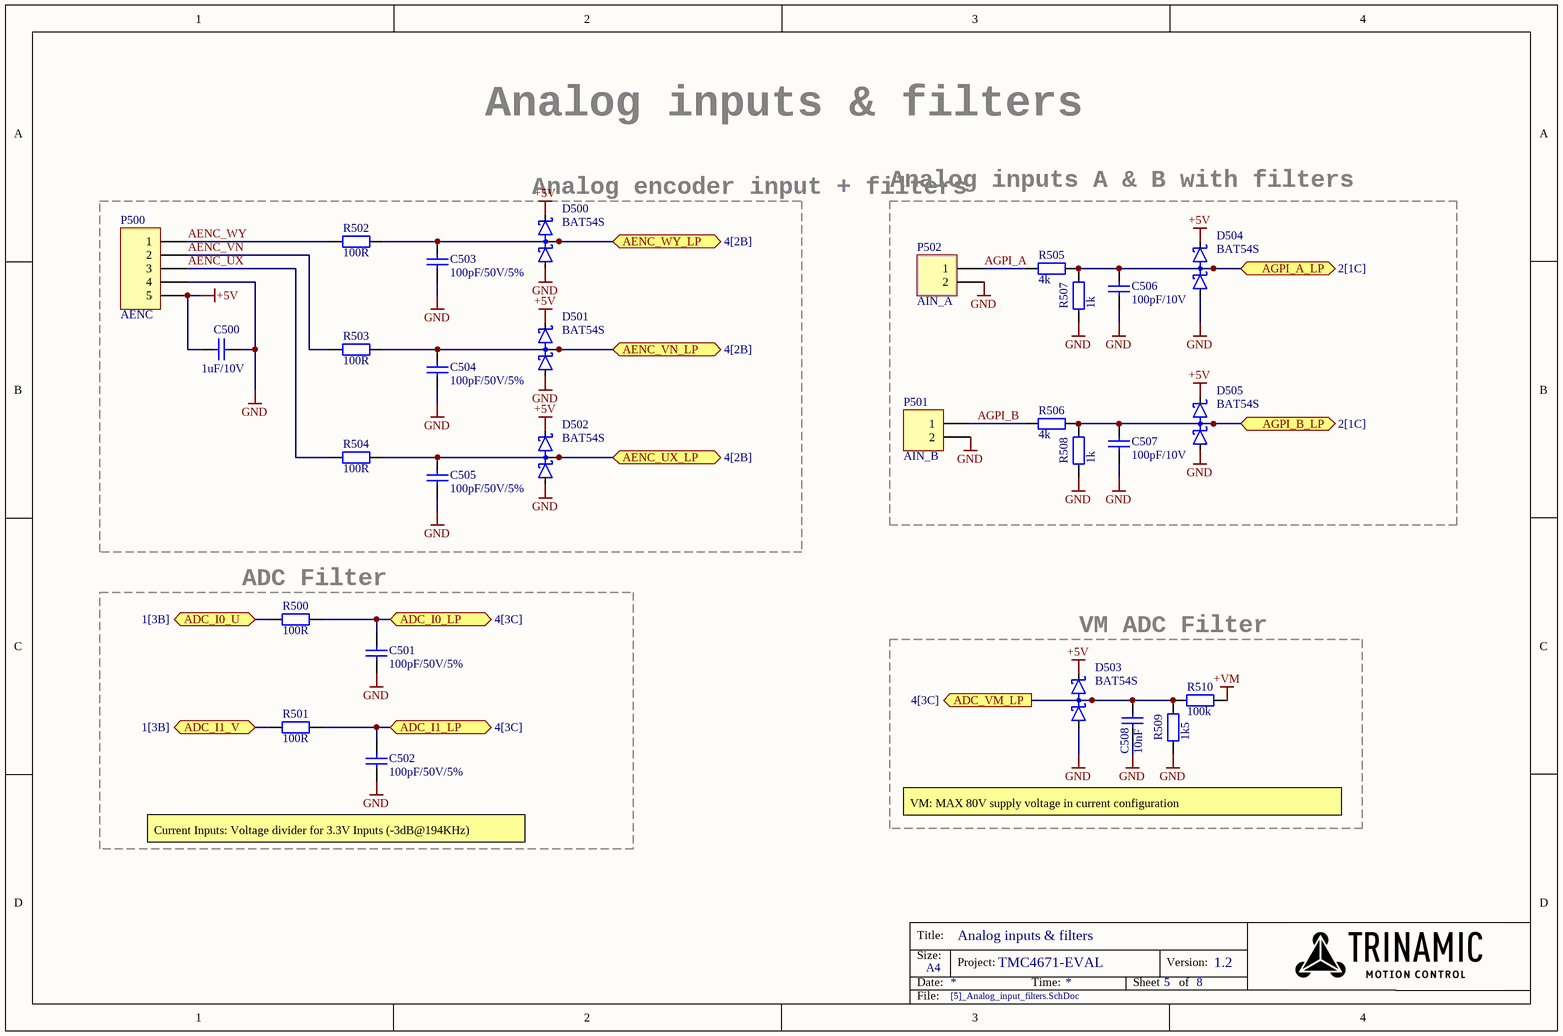
[diagram p6: [5]_Analog_input_filters.SchDoc]

### Parts
C500  1uF/10V  [C0603]
C501  100pF/50V/5%  [C0603]
C502  100pF/50V/5%  [C0603]
C503  100pF/50V/5%  [C0603]
C504  100pF/50V/5%  [C0603]
C505  100pF/50V/5%  [C0603]
C506  100pF/10V  [C0603]
C507  100pF/10V  [C0603]
C508  10nF  [C0603]
D500  BAT54S  [SOT95P237X130-3N]
D501  BAT54S  [SOT95P237X130-3N]
D502  BAT54S  [SOT95P237X130-3N]
D503  BAT54S  [SOT95P237X130-3N]
D504  BAT54S  [SOT95P237X130-3N]
D505  BAT54S  [SOT95P237X130-3N]
P500  AENC  [TH_HDR_1X5]
P501  AIN_B  [TH_HDR_1X2]
P502  AIN_A  [TH_HDR_1X2]
R500  100R  [R0603]
R501  100R  [R0603]
R502  100R  [R0603]
R503  100R  [R0603]
R504  100R  [R0603]
R505  4k  [R0805]
R506  4k  [R0805]
R507  1k  [R0603]
R508  1k  [R0603]
R509  1k5  [R0603]
R510  100k  [R0603]

### Blocks framed on the sheet
Analog encoder input + filters: C500 C503-C505 D500-D502 P500 R502-R504
Analog inputs A & B with filters: C506 C507 D504 D505 P501 P502 R505-R508
ADC Filter: C501 C502 R500 R501

### Ports
ADC_I0_LP (see 4[3C]), ADC_I0_U (see 1[3B]), ADC_I1_LP (see 4[3C]), ADC_I1_V (see 1[3B]), ADC_VM_LP (out, see 4[3C]), AENC_UX_LP (see 4[2B]), AENC_VN_LP (see 4[2B]), AENC_WY_LP (see 4[2B]), AGPI_A_LP (see 2[1C]), AGPI_B_LP (see 2[1C])

### Nets
+5V: C500.2 D500.2(C2) D501.2(C2) D502.2(C2) D503.2(C2) D504.2(C2) D505.2(C2) P500.5
+VM: R510.2
GND: C500.1 C501.1 C502.1 C503.1 C504.1 C505.1 C506.1 C507.1 C508.1 D500.1(A1) D501.1(A1) D502.1(A1) D503.1(A1) D504.1(A1) D505.1(A1) P500.4 P501.2 P502.2 R507.2 R508.2 R509.2
ADC_I0_LP: C501.2 R500.1 ; port ADC_I0_LP
ADC_I0_U: R500.2 ; port ADC_I0_U
ADC_I1_LP: C502.2 R501.1 ; port ADC_I1_LP
ADC_I1_V: R501.2 ; port ADC_I1_V
ADC_VM_LP: C508.2 D503.3(C1A2) R509.1 R510.1 ; port ADC_VM_LP
AENC_UX: P500.3 R504.2
AENC_UX_LP: C505.2 D502.3(C1A2) R504.1 ; port AENC_UX_LP
AENC_VN: P500.2 R503.2
AENC_VN_LP: C504.2 D501.3(C1A2) R503.1 ; port AENC_VN_LP
AENC_WY: P500.1 R502.2
AENC_WY_LP: C503.2 D500.3(C1A2) R502.1 ; port AENC_WY_LP
AGPI_A: P502.1 R505.2
AGPI_A_LP: C506.2 D504.3(C1A2) R505.1 R507.1 ; port AGPI_A_LP
AGPI_B: P501.1 R506.2
AGPI_B_LP: C507.2 D505.3(C1A2) R506.1 R508.1 ; port AGPI_B_LP

### Notes on the sheet
- (near D503) VM ADC Filter
- (near C502) Current Inputs: Voltage divider for 3.3V Inputs (-3dB@194KHz)
- VM: MAX 80V supply voltage in current configuration
- Title:
- Size:
- Date:
- A4
- Project:
- Time:
- Sheet
- Version:
- of
- File:

### Library data of the parts
C500 = C, 1 µF, 10 V, ± 10%, X5R, MC Series, 0603 [1608 Metric]: as C300 on sheet [3]_Output_Feedback; Characteristic: X5R; Precision: 10%
C501-C505 = C, 100 pF, 50 V, ± 5%, C0G / NP0, MC Series, 0603 [1608 Metric]: as C304 on sheet [3]_Output_Feedback; Characteristic: C0G / NP0; Precision: 5%
C506 C507 = C, 100 pF, 10 V, ± 1%, C0G / NP0, MCMT Series, 0603 [1608 Metric]: SMD Multilayer Ceramic Capacitor, 0603 [1608 Metric], 100 pF, 10 V, ± 1%, C0G / NP0, MCMT Series; MPN: MCMT18N101F100CT; Type: MLCC; VoltageRating: 10V; MF: MULTICOMP; Capacitance: 100pF; Characteristic: C0G / NP0; Precision: 1%
C508 = C, 10nF, 10 V, ± 10%, X7R, 0603: SMD Multilayer Ceramic Capacitor, 0603 [1608 Metric], 0.01 µF, 10 V, ± 10%, X7R, MCSH Series; MPN: MCSH18B103K100CT; Type: MLCC; VoltageRating: 10V; MF: MULTICOMP; Characteristic: X7R; Capacitance: 10nF; Precision: 10%
D500-D505 = BAT54S: as D200 on sheet [2]_Communication_Inputs; MPN: BAT54S
P500 = Header 5: Header, 5-Pin
P501 P502 = Header 2: Header, 2-Pin
R500-R504 = R, 100 ohm, 50 V, 0603 [1608 Metric], 100 mW, ± 1%, MCWR Series: SMD Chip Resistor, Thick Film, 100 ohm, 50 V, 0603 [1608 Metric], 100 mW, ± 1%, MCWR Series; MPN: MCWR06X1000FTL; VoltageRating: 50V; Temp coefficient: *ppm; PowerRating: 100mW; MF: MULTICOMP; Precision: 1%; Resistance: 100R
R505 R506 = R, 4 kohm, 150 V, 0805 [2012 Metric], 125 mW, ± 1%, CRCW Series: SMD Chip Resistor, Thick Film, 4 kohm, 150 V, 0805 [2012 Metric], 125 mW, ± 1%, CRCW Series; MPN: CRCW08054K00FKTA; VoltageRating: 150V; Temp coefficient: *ppm; PowerRating: 125mW; MF: VISHAY; Precision: 1%; Resistance: 4k
R507 R508 = R, 1 kohm, 50 V, 0603 [1608 Metric], 63 mW, ± 1%, MC Series: SMD Chip Resistor, Thick Film, 1 kohm, 50 V, 0603 [1608 Metric], 100 mW, ± 0.5%, RE Series; MPN: MC0063W060311K; Precision: 1%; VoltageRating: 50V; Temp coefficient: *ppm; PowerRating: 63mW; MF: MULTICOMP; Resistance: 1k
R509 = R, 1.5 kohm, 50 V, 0603 [1608 Metric], 100 mW, ± 1%, MCWR Series: SMD Chip Resistor, Thick Film, 1.5 kohm, 50 V, 0603 [1608 Metric], 100 mW, ± 1%, MCWR Series; MPN: MCWR06X1501FTL; VoltageRating: 50V; Temp coefficient: *ppm; PowerRating: 63mW; MF: MULTICOMP; Precision: 1%; Resistance: 1k5
R510 = R, 100 kohm, 50 V, 0603 [1608 Metric], 100 mW, ± 1%, MCWR Series: SMD Chip Resistor, Thick Film, 100 kohm, 50 V, 0603 [1608 Metric], 100 mW, ± 1%, MCWR Series; MPN: MCWR06X1003FTL; Temp coefficient: *ppm; MF: MULTICOMP; Precision: 1%; Resistance: 100k

## Sheet [6]_PSU.SchDoc: PSU
size A4; DocumentNumber: 6; SheetNumber: 6; SheetTotal: 8
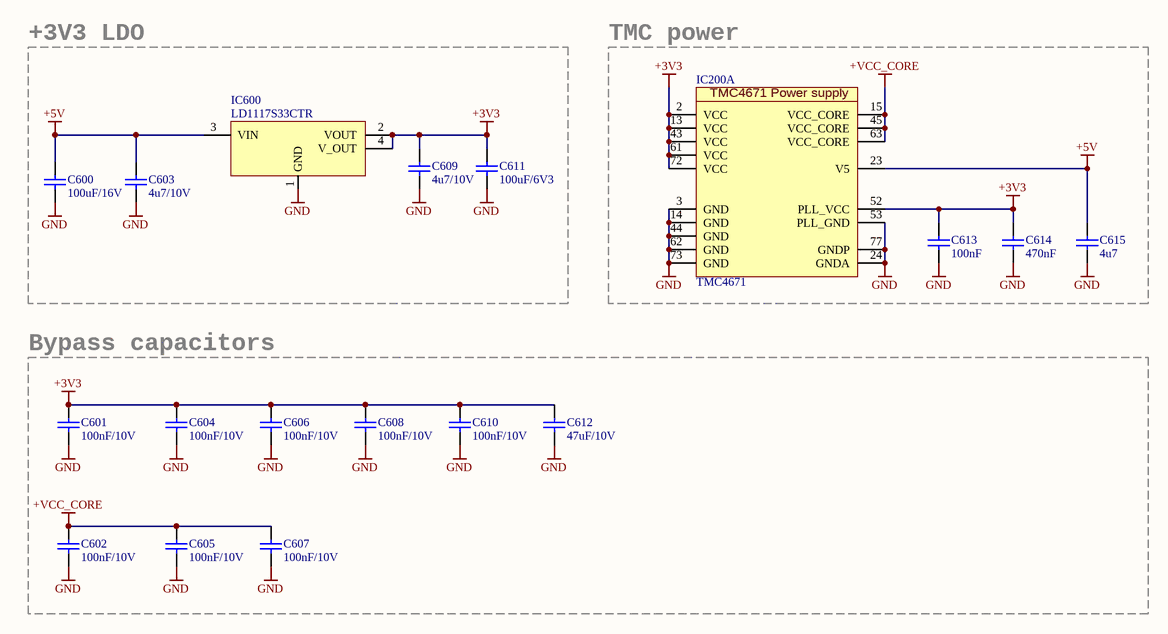
[diagram p7: [6]_PSU.SchDoc]

### Parts
C600  100uF/16V  [C1210]
C601  100nF/10V  [C0603]
C602  100nF/10V  [C0603]
C603  4u7/10V  [C0603]
C604  100nF/10V  [C0603]
C605  100nF/10V  [C0603]
C606  100nF/10V  [C0603]
C607  100nF/10V  [C0603]
C608  100nF/10V  [C0603]
C609  4u7/10V  [C0603]
C610  100nF/10V  [C0603]
C611  100uF/6V3  [C1210]
C612  47uF/10V  [C1206]
C613  100nF  [C0603]
C614  470nF  [C0603]
C615  4u7  [C0603]
IC200  TMC4671  [QFN40P1050X650X90_HS-77N]  (part A of 5)
IC600  LD1117S33CTR  [SOT230P700X180-4N]

### Blocks framed on the sheet
+3V3 LDO: C600 C603 C609 C611 IC600
TMC power: C613-C615 IC200
Bypass capacitors: C601 C602 C604-C608 C610 C612

### Nets
+3V3: C601.2 C604.2 C606.2 C608.2 C609.2 C610.2 C611.2 C612.2 C613.2 C614.1 IC200.2(VCC) IC200.13(VCC) IC200.43(VCC) IC200.52(PLL_VCC) IC200.61(VCC) IC200.72(VCC) IC600.2(VOUT) IC600.4(V_OUT)
+5V: C600.2 C603.2 C615.2 IC200.23(V5) IC600.3(VIN)
+VCC_CORE: C602.2 C605.2 C607.2 IC200.15(VCC_CORE) IC200.45(VCC_CORE) IC200.63(VCC_CORE)
GND: C600.1 C601.1 C602.1 C603.1 C604.1 C605.1 C606.1 C607.1 C608.1 C609.1 C610.1 C611.1 C612.1 C613.1 C614.2 C615.1 IC200.3(GND) IC200.14(GND) IC200.24(GNDA) IC200.44(GND) IC200.53(PLL_GND) IC200.62(GND) IC200.73(GND) IC200.77(GNDP) IC600.1(GND)

### Notes on the sheet
- Title:
- Size:
- Date:
- A4
- Project:
- Time:
- Sheet
- Version:
- of
- File:
- (in symbol TMC4671, part A) TMC4671 Power supply

### Library data of the parts
C600 = C, 100 µF, 16 V, ± 20%, X5R, M Series, 1210: SMD Multilayer Ceramic Capacitor, 1210 [3225 Metric], 100 µF, 16 V, ± 20%, X5R, M Series; MPN: EMK325ABJ107MM-T; Type: MLCC; VoltageRating: 16V; MF: TAIYO YUDEN; Capacitance: 100uF; Characteristic: X5R; Precision: 20%
C601 C602 C604-C608 C610 = C, 0.1 µF, 10 V, ± 10%, X7R, 0603: as C200 on sheet [2]_Communication_Inputs; Characteristic: X7R; ComponentLinknURL: *; Precision: 10%
C603 C609 = C, 4.7 µF, 10 V, ± 10%, X5R, MC Series , 0603: SMD Multilayer Ceramic Capacitor, 0603 [1608 Metric], 4.7 µF, 10 V, ± 10%, X5R, MC Series; MPN: MC0603X475K100CT; Type: MLCC; VoltageRating: 10V; MF: MULTICOMP; Capacitance: 4u7; Characteristic: X5R; Precision: 10%
C611 = C, 100 µF, 6.3 V, ± 20%, X5R, GRM Series, 1210: SMD Multilayer Ceramic Capacitor, 1210 [3225 Metric], 100 µF, 6.3 V, ± 20%, X5R, GRM Series; MPN: GRM31CR60J107ME39L.; Type: MLCC; VoltageRating: 6V3; MF: MURATA; Capacitance: 100uF; Characteristic: X5R; Precision: 20%
C612 = C, 47 µF, 10 V, ± 20%, X7R, MC Series , 1206: SMD Multilayer Ceramic Capacitor, 1206 [3216 Metric], 47 µF, 10 V, ± 20%, X5R, GRM Series; MPN: GRM31CR61A476ME15L; Type: MLCC; VoltageRating: 10V; MF: MURATA; Capacitance: 47uF; Characteristic: X5R; Precision: 20%
C613 = C, 0.1 µF, 10 V, ± 10%, X7R, 0603: SMD Multilayer Ceramic Capacitor, 0603 [1608 Metric], 0.1 µF, 10 V, ± 10%, X7R, MC Series; MPN: MC0603B104K100CT; Type: MLCC; VoltageRating: 10V; MF: Multicomp; Characteristic: X7R; ComponentLinknURL: *; Capacitance: 100nF; Precision: 10%
C614 = C, 0.47 µF, 16 V, ± 10%, X5R, MC Series, 0603 [1608 Metric]: SMD Multilayer Ceramic Capacitor, 0603 [1608 Metric], 0.47 µF, 16 V, ± 10%, X5R, MC Series; MPN: MC0603X474K160CT; Type: MLCC; Voltage rating: 16V; ComponentLinknDescription: Datasheet; MF: Multicomp; Characteristic: X5R; ComponentLinknURL: *; Capacitance: 470nF; Precision: 10%
C615 = C, 4.7 µF, 10 V, ± 10%, X5R, MC Series , 0603: SMD Multilayer Ceramic Capacitor, 0603 [1608 Metric], 4.7 µF, 10 V, ± 10%, X5R, MC Series; MPN: MC0603X475K100CT; Type: MLCC; VoltageRating: 10V; MF: MULTICOMP; Characteristic: X5R; Capacitance: 4u7; Precision: 10%
IC200 = TMC4671: MF: TRINAMIC; MPN: TMC4671
IC600 = LDO_LD1117S33CTR: Fixed LDO Voltage Regulator, 4.75V to 15V, 1.1V Dropout, 3.3Vout, 950mAout, SOT-223-4; MF: STMICROELECTRONICS; MPN: LD1117S33CTR

## Nets that join several sheets
+3V3: [1]_InterfaceConnectors (TP1.1), [2]_Communication_Inputs (7 pins), [3]_Output_Feedback (8 pins), [6]_PSU (18 pins)
+5V: [1]_InterfaceConnectors (P1.42 P2.42 TP2.1), [3]_Output_Feedback (20 pins), [4]_Output_Feedback_2 (5 pins), [5]_Analog_input_filters (8 pins), [6]_PSU (5 pins)
+VM: [1]_InterfaceConnectors (P1.1 P2.1), [5]_Analog_input_filters (R510.2)
GND: [1]_InterfaceConnectors (17 pins), [2]_Communication_Inputs (13 pins), [3]_Output_Feedback (28 pins), [4]_Output_Feedback_2 (6 pins), [5]_Analog_input_filters (21 pins), [6]_PSU (25 pins)
ADC_I0_LP: [4]_Output_Feedback_2 (IC200.16), [5]_Analog_input_filters (C501.2 R500.1)
ADC_I0_U: [1]_InterfaceConnectors (P2.15), [5]_Analog_input_filters (R500.2)
ADC_I1_LP: [4]_Output_Feedback_2 (IC200.18), [5]_Analog_input_filters (C502.2 R501.1)
ADC_I1_V: [1]_InterfaceConnectors (P2.14), [5]_Analog_input_filters (R501.2)
ADC_VM_LP: [4]_Output_Feedback_2 (IC200.20), [5]_Analog_input_filters (C508.2 D503.3 R509.1 R510.1)
AENC_UX_INN: [1]_InterfaceConnectors (TP11.1), [4]_Output_Feedback_2 (IC200.26 R404.1 R405.2)
AENC_UX_LP: [4]_Output_Feedback_2 (IC200.25), [5]_Analog_input_filters (C505.2 D502.3 R504.1)
AENC_VN_INN: [1]_InterfaceConnectors (TP12.1), [4]_Output_Feedback_2 (IC200.28 R402.1 R403.2)
AENC_VN_LP: [4]_Output_Feedback_2 (IC200.27), [5]_Analog_input_filters (C504.2 D501.3 R503.1)
AENC_WY_INN: [1]_InterfaceConnectors (TP13.1), [4]_Output_Feedback_2 (IC200.30 R400.1 R401.2)
AENC_WY_LP: [4]_Output_Feedback_2 (IC200.29), [5]_Analog_input_filters (C503.2 D500.3 R502.1)
AGPI_A_LP: [2]_Communication_Inputs (IC200.21), [5]_Analog_input_filters (C506.2 D504.3 R505.1 R507.1)
AGPI_B_LP: [2]_Communication_Inputs (IC200.22), [5]_Analog_input_filters (C507.2 D505.3 R506.1 R508.1)
CLK25: [1]_InterfaceConnectors (P1.23), [2]_Communication_Inputs (IC200.51 XTL200.3)
CS_CH0: [1]_InterfaceConnectors (P1.6), [2]_Communication_Inputs (IC201.1)
DBG_SPI_MISO: [1]_InterfaceConnectors (TP9.1), [2]_Communication_Inputs (IC200.4 P201.9)
DBG_SPI_MOSI: [1]_InterfaceConnectors (TP8.1), [2]_Communication_Inputs (IC200.1 P201.7)
DBG_SPI_nSCS: [1]_InterfaceConnectors (TP6.1), [2]_Communication_Inputs (IC200.75 P201.3)
DBG_SPI_SCK: [1]_InterfaceConnectors (TP7.1), [2]_Communication_Inputs (IC200.76 P201.5)
DBG_SPI_TRG: [1]_InterfaceConnectors (TP10.1), [2]_Communication_Inputs (IC200.5 P201.4)
EN_IN: [1]_InterfaceConnectors (P1.8), [2]_Communication_Inputs (IC200.55)
EN_OUT: [1]_InterfaceConnectors (P2.40), [2]_Communication_Inputs (IC200.32)
ENC1_A: [3]_Output_Feedback (IC300.2), [4]_Output_Feedback_2 (IC200.35)
ENC1_B: [3]_Output_Feedback (IC300.5), [4]_Output_Feedback_2 (IC200.34)
ENC1_N: [3]_Output_Feedback (IC300.7), [4]_Output_Feedback_2 (IC200.33)
ENC2_A: [3]_Output_Feedback (IC301.2), [4]_Output_Feedback_2 (IC200.64)
ENC2_B: [3]_Output_Feedback (IC301.5), [4]_Output_Feedback_2 (IC200.65)
ENC2_N: [3]_Output_Feedback (IC301.7), [4]_Output_Feedback_2 (IC200.66)
GPIO0: [1]_InterfaceConnectors (P1.35 TP3.1), [2]_Communication_Inputs (IC200.70)
GPIO1: [1]_InterfaceConnectors (P1.37 TP4.1), [2]_Communication_Inputs (IC200.71)
GPIO2: [1]_InterfaceConnectors (TP5.1), [2]_Communication_Inputs (IC200.74)
HALL_UX: [3]_Output_Feedback (IC302.2), [4]_Output_Feedback_2 (IC200.38)
HALL_V: [3]_Output_Feedback (IC302.5), [4]_Output_Feedback_2 (IC200.37)
HALL_WY: [3]_Output_Feedback (IC302.7), [4]_Output_Feedback_2 (IC200.36)
PWM_H_IDLE: [1]_InterfaceConnectors (P2.34), [4]_Output_Feedback_2 (IC200.59)
PWM_IN: [1]_InterfaceConnectors (P1.21), [2]_Communication_Inputs (D200.3 IC200.58 P202.1)
PWM_L_IDLE: [1]_InterfaceConnectors (P2.35), [4]_Output_Feedback_2 (IC200.60)
PWM_UX1_H: [1]_InterfaceConnectors (P2.18), [4]_Output_Feedback_2 (IC200.39)
PWM_UX1_L: [1]_InterfaceConnectors (P2.17), [4]_Output_Feedback_2 (IC200.40)
PWM_VX2_H: [1]_InterfaceConnectors (P2.20), [4]_Output_Feedback_2 (IC200.41)
PWM_VX2_L: [1]_InterfaceConnectors (P2.19), [4]_Output_Feedback_2 (IC200.42)
PWM_WY1_H: [1]_InterfaceConnectors (P2.22), [4]_Output_Feedback_2 (IC200.46)
PWM_WY1_L: [1]_InterfaceConnectors (P2.21), [4]_Output_Feedback_2 (IC200.47)
PWM_Y2_H: [1]_InterfaceConnectors (P2.23), [4]_Output_Feedback_2 (IC200.48)
PWM_Y2_L: [1]_InterfaceConnectors (P2.26), [4]_Output_Feedback_2 (IC200.49)
REF_H: [3]_Output_Feedback (IC303.5), [4]_Output_Feedback_2 (IC200.68)
REF_L: [3]_Output_Feedback (IC303.2), [4]_Output_Feedback_2 (IC200.67)
REF_R: [3]_Output_Feedback (IC303.7), [4]_Output_Feedback_2 (IC200.69)
SD_DIR: [1]_InterfaceConnectors (P1.18), [2]_Communication_Inputs (IC200.56)
SD_STP: [1]_InterfaceConnectors (P1.17), [2]_Communication_Inputs (IC200.57)
SPI_MISO: [1]_InterfaceConnectors (P1.33), [2]_Communication_Inputs (IC200.9 IC201.2)
SPI_MOSI: [1]_InterfaceConnectors (P1.32), [2]_Communication_Inputs (IC200.8 IC201.5)
SPI_nSCS: [1]_InterfaceConnectors (P1.30), [2]_Communication_Inputs (IC200.6)
SPI_SCK: [1]_InterfaceConnectors (P1.31), [2]_Communication_Inputs (IC200.7 IC201.6)
STATUS: [1]_InterfaceConnectors (P1.13), [2]_Communication_Inputs (IC200.12)
UART_RXD: [1]_InterfaceConnectors (P1.39), [2]_Communication_Inputs (IC200.10 P200.3)
UART_TXD: [1]_InterfaceConnectors (P1.40), [2]_Communication_Inputs (IC200.11 P200.2)

## Assembly variants
Variant of TMC4671-EVAL_V1_0: not fitted P200 P202